# Altium schematic sheet Servo_buffer.SchDoc
size A4
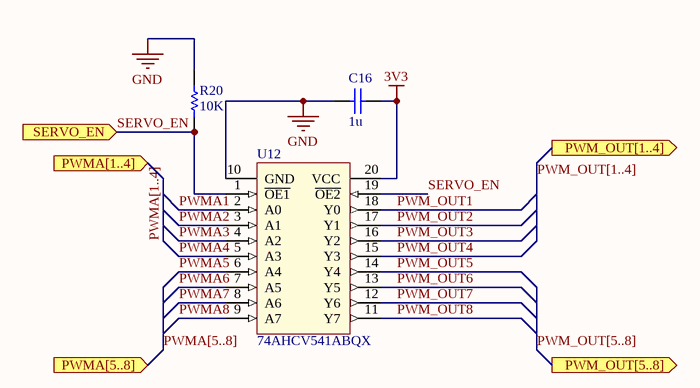
[diagram p0: Servo_buffer.SchDoc]

## Parts
C16  value 1u  [CAPC1608X90N]  (hidden comment: Cap)
R20  value 10K  [RESC1608X55N]  (hidden comment: Res1)
U12  74AHCV541ABQX  [TSSOP20_4.4mm]

## Ports
PWM_OUT[1..4] (out), PWM_OUT[5..8] (out), PWMA[1..4] (in), PWMA[5..8] (in), SERVO_EN (in)

## Nets
3V3: C16.2 U12.20(VCC)
GND: C16.1 R20.2 U12.10(GND)
PWM_OUT1: U12.18(Y0)
PWM_OUT2: U12.17(Y1)
PWM_OUT3: U12.16(Y2)
PWM_OUT4: U12.15(Y3)
PWM_OUT5: U12.14(Y4)
PWM_OUT6: U12.13(Y5)
PWM_OUT7: U12.12(Y6)
PWM_OUT8: U12.11(Y7)
PWMA1: U12.2(A0)
PWMA2: U12.3(A1)
PWMA3: U12.4(A2)
PWMA4: U12.5(A3)
PWMA5: U12.6(A4)
PWMA6: U12.7(A5)
PWMA7: U12.8(A6)
PWMA8: U12.9(A7)
SERVO_EN: R20.1 U12.1(~{OE1}) U12.19(~{OE2}) ; port SERVO_EN

## Buses and harness runs
bus PWM_OUT[1..4] = port PWM_OUT[1..4]
bus PWM_OUT[5..8] = port PWM_OUT[5..8]
bus PWMA[1..4] = port PWMA[1..4]
bus PWMA[5..8] = port PWMA[5..8]

## Library data of the parts
C16 = Cap: Capacitor; Published: 8-Jun-2000; LatestRevisionDate: 17-Jul-2002; LatestRevisionNote: Re-released for DXP Platform.; PackageReference: RAD-0.3; Publisher: Altium Limited; PackageDescription: Radial Cap, Thru-Hole; 2 Leads; 0.3 in Pin Spacing
R20 = Res1: Resistor; Published: 8-Jun-2000; LatestRevisionDate: 17-Jul-2002; LatestRevisionNote: Re-released for DXP Platform.; PackageReference: AXIAL-0.3; Publisher: Altium Limited; PackageDescription: Axial Device, Thru-Hole; 2 Leads; 0.3 in Pin Spacing
U12 = 74AHCV541ABQX: Octal buffer/line driver; 3-state; Source: https://www.mouser.hk/ProductDetail/Nexperia/74AHCV244APWJ?qs=sGAEpiMZZMuiiWkaIwCK2bgmxBV%2FR64eEE4cbZSq%2Ff0=; ComponentLink1Description: purchase; ComponentLink1URL: https://www.mouser.hk/ProductDetail/Nexperia/74AHCV244APWJ?qs=sGAEpiMZZMuiiWkaIwCK2bgmxBV%2FR64eEE4cbZSq%2Ff0=